# Altium schematic sheet плп-u_2с.SchDoc
size 594 x 420 mm; PageSetup: Record=PageOptions|CenterHorizontal=False|CenterVertical=False|PrintScale=0.68|XCorrection=0.00|YCorrection=0.00|PrintKind=2|BorderSize=5000000|LeftOffset=0|BottomOffset=0|Orientation=2|PaperLength=4200|PaperWidth=2970|Scale=100|PaperSource=7|PrintQuality=600|MediaType=1|DitherType=10|PaperKind=A3|PrintScaleMode=1; Rule: PcbType=ProtelPcb; Rule: PcbType=ProtelPcb; Rule: PcbType=ProtelPcb; Rule: PcbType=ProtelPcb; Rule: PcbType=ProtelPcb; Rule: PcbType=ProtelPcb; Rule: PcbType=ProtelPcb; Rule: PcbType=ProtelPcb; Rule: PcbType=ProtelPcb; Rule: PcbType=ProtelPcb; Rule: PcbType=ProtelPcb; Rule: PcbType=ProtelPcb
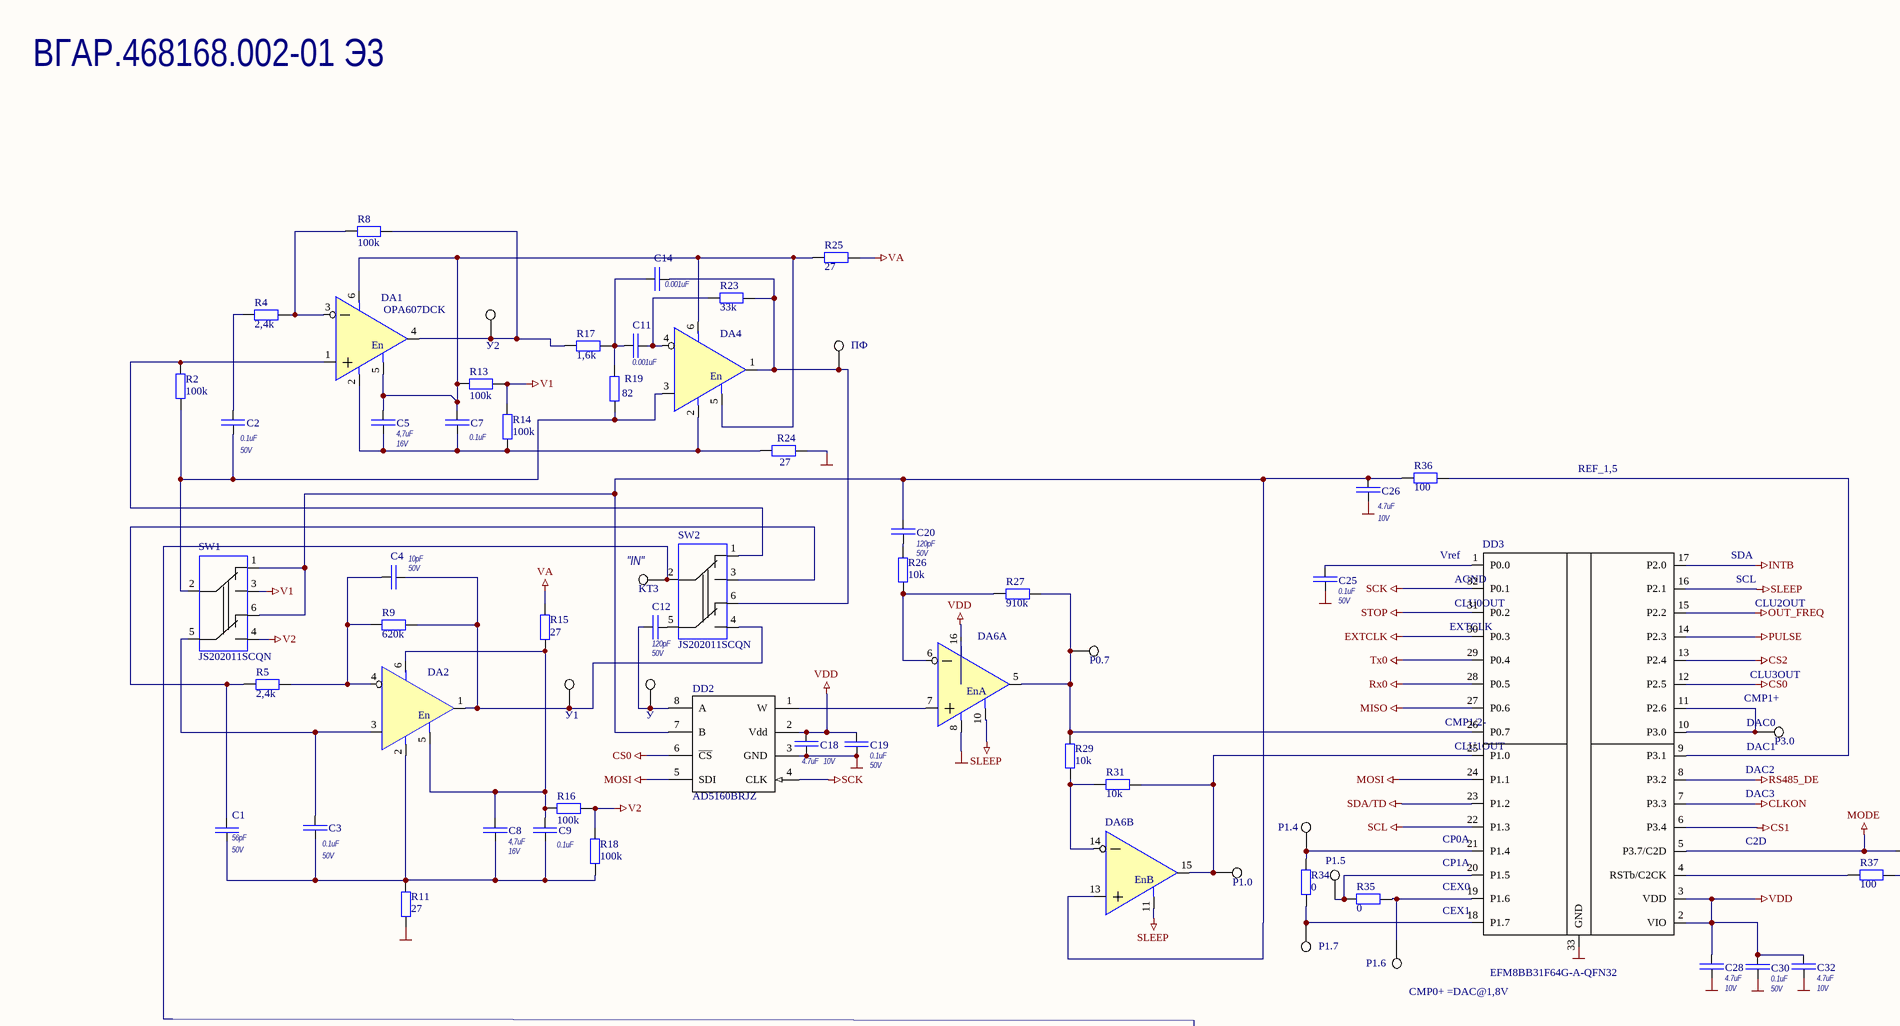
[diagram p0: плп-u_2с.SchDoc, top left]
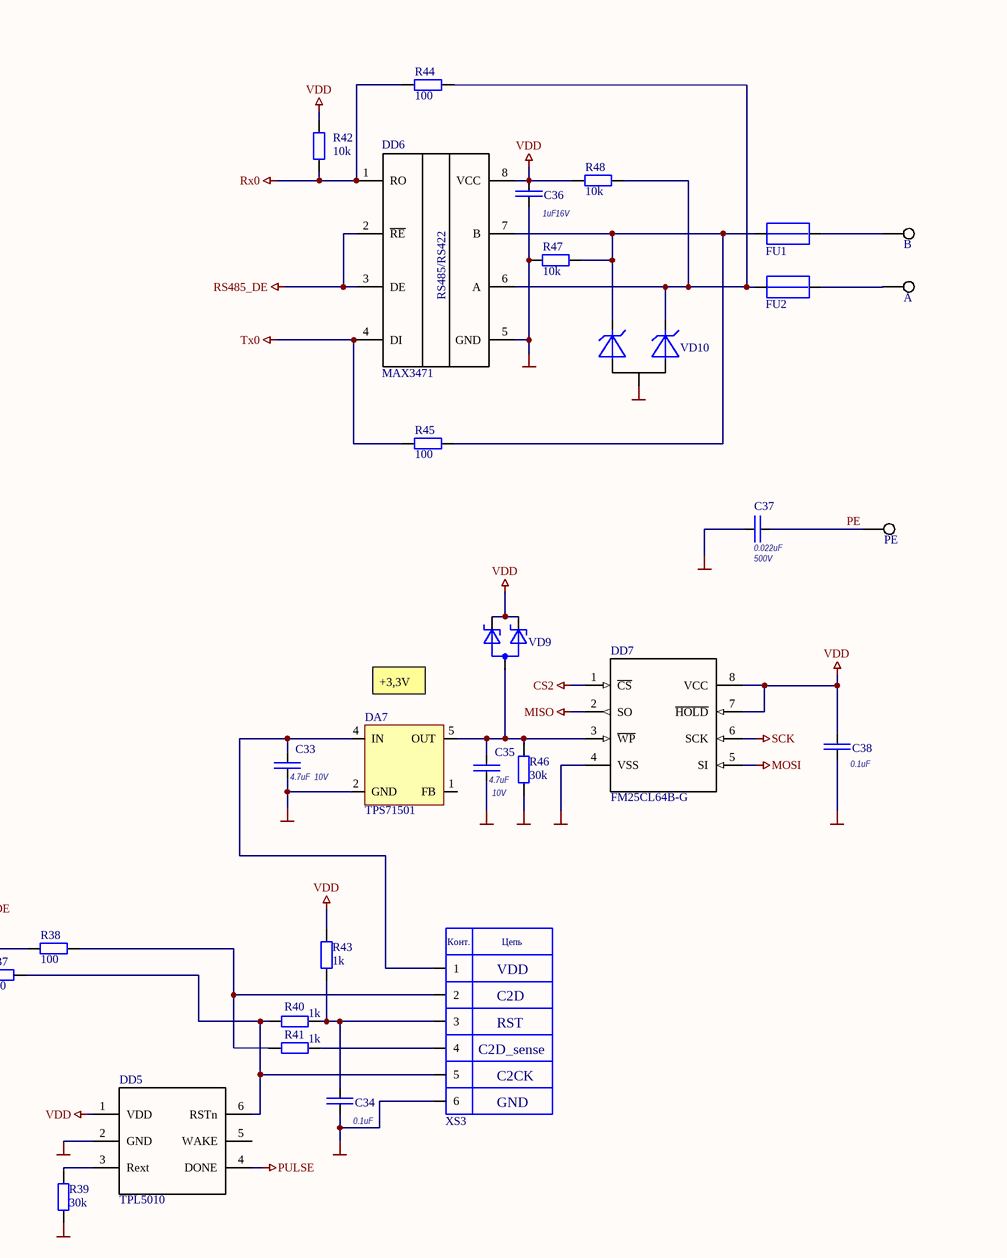
[diagram p1: плп-u_2с.SchDoc, top right]
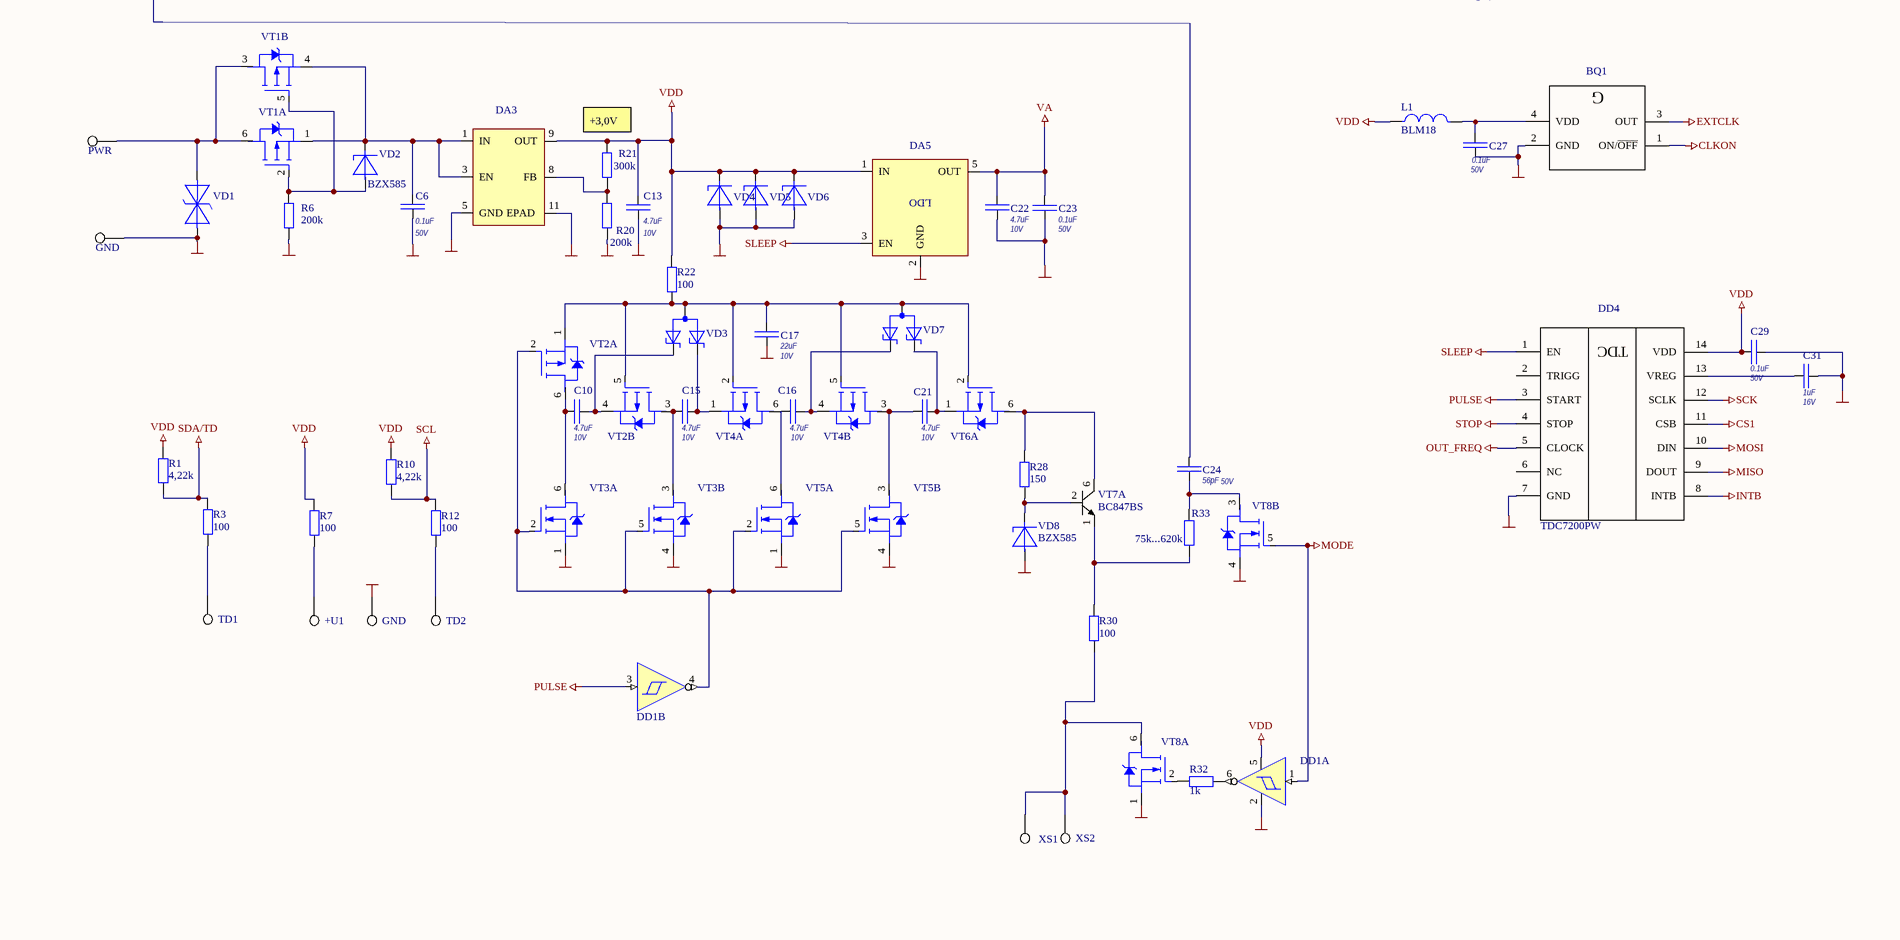
[diagram p2: плп-u_2с.SchDoc, bottom left]
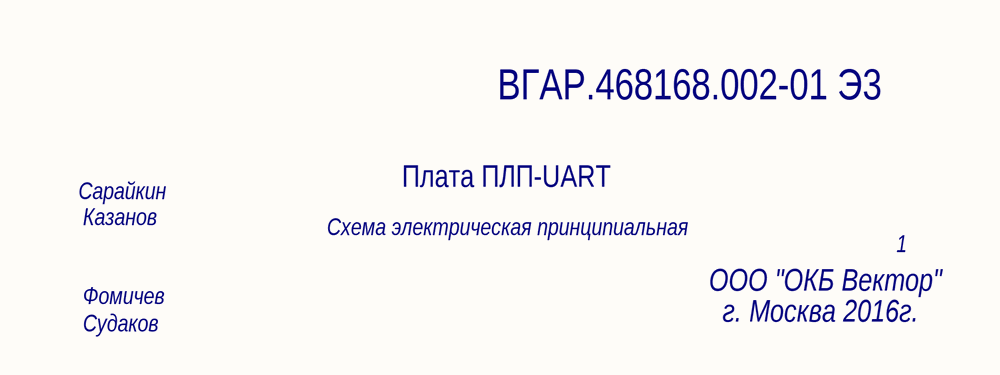
[diagram p3: плп-u_2с.SchDoc, bottom right]

## Parts
(Parts that share a designator on the sheet are numbered #1, #2 ... from top to bottom, then left to right.)
+U1  Testpoint-TH-1mm  [1mm PAD]  (value not drawn)  (net tie, no BOM)
A  Testpoint-TH-1mm  [1mm PAD]  (value not drawn)  (net tie, no BOM)
B  Testpoint-TH-1mm  [1mm PAD]  (value not drawn)  (net tie, no BOM)
BQ1  AMPMG  [AMPMG]  (value not drawn)
C1  value 56pF  Rated DC Voltage: 50V  [CAPC_0603(1608)X080L]  (hidden comment: Capacitor Ceramic)
C2  value 0.1uF  Rated DC Voltage: 50V  [CAPC_0603(1608)X080L]  (hidden comment: Capacitor Ceramic)
C3  value 0.1uF  Rated DC Voltage: 50V  [CAPC_0603(1608)X080L]  (hidden comment: Capacitor Ceramic)
C4  value 10pF  Rated DC Voltage: 50V  [CAPC_0603(1608)X080L]  (hidden comment: Capacitor Ceramic)
C5  value 4,7uF  Rated DC Voltage: 16V  [CAPC_0603(1608)X080L]  (hidden comment: Capacitor Ceramic)
C6  value 0.1uF  Rated DC Voltage: 50V  [CAPC_0603(1608)X080L]  (hidden comment: Capacitor Ceramic)
C7  value 0.1uF  [CAPC_0603(1608)X080L]  (hidden comment: Capacitor Ceramic)
C8  value 4,7uF  Rated DC Voltage: 16V  [CAPC_0603(1608)X080L]  (hidden comment: Capacitor Ceramic)
C9  value 0.1uF  [CAPC_0603(1608)X080L]  (hidden comment: Capacitor Ceramic)
C10  value 4.7uF  Rated DC Voltage: 10V  [CAPC_0603(1608)X080L]  (hidden comment: Capacitor Ceramic)
C11  value 0.001uF  [CAPC_0603(1608)X080L]  (hidden comment: Capacitor Ceramic)
C12  value 120pF  Rated DC Voltage: 50V  [CAPC_0603(1608)X080L]  (hidden comment: Capacitor Ceramic)
C13  value 4.7uF  Rated DC Voltage: 10V  [CAPC_0603(1608)X080L]  (hidden comment: Capacitor Ceramic)
C14  value 0.001uF  [CAPC_0603(1608)X080L]  (hidden comment: Capacitor Ceramic)
C15  value 4.7uF  Rated DC Voltage: 10V  [CAPC_0603(1608)X080L]  (hidden comment: Capacitor Ceramic)
C16  value 4.7uF  Rated DC Voltage: 10V  [CAPC_0603(1608)X080L]  (hidden comment: Capacitor Ceramic)
C17  value 22uF  Rated DC Voltage: 10V  [CAPC_0603(1608)X080L]  (hidden comment: Capacitor Ceramic)
C18  value 4.7uF  Rated DC Voltage: 10V  [CAPC_0603(1608)X080L]  (hidden comment: Capacitor Ceramic)
C19  value 0.1uF  Rated DC Voltage: 50V  [CAPC_0603(1608)X080L]  (hidden comment: Capacitor Ceramic)
C20  value 120pF  Rated DC Voltage: 50V  [CAPC_0603(1608)X080L]  (hidden comment: Capacitor Ceramic)
C21  value 4.7uF  Rated DC Voltage: 10V  [CAPC_0603(1608)X080L]  (hidden comment: Capacitor Ceramic)
C22  value 4.7uF  Rated DC Voltage: 10V  [CAPC_0603(1608)X080L]  (hidden comment: Capacitor Ceramic)
C23  value 0.1uF  Rated DC Voltage: 50V  [CAPC_0603(1608)X080L]  (hidden comment: Capacitor Ceramic)
C24  value 56pF  Rated DC Voltage: 50V  [CAPC_0603(1608)X080L]  (hidden comment: Capacitor Ceramic)
C25  Rated DC Voltage: 50V  [CAPC_0603(1608)X080L]  (hidden comment: 0.1uF)
C26  value 4.7uF  Rated DC Voltage: 10V  [CAPC_0603(1608)X080L]  (hidden comment: Capacitor Ceramic)
C27  Rated DC Voltage: 50V  [CAPC_0603(1608)X080L]  (hidden comment: 0.1uF)
C28  value 4.7uF  Rated DC Voltage: 10V  [CAPC_0603(1608)X080L]  (hidden comment: Capacitor Ceramic)
C29  Rated DC Voltage: 50V  [CAPC_0603(1608)X080L]  (hidden comment: 0.1uF)
C30  Rated DC Voltage: 50V  [CAPC_0603(1608)X080L]  (hidden comment: 0.1uF)
C31  Rated DC Voltage: 16V  [CAPC_0603(1608)X080L]  (hidden comment: 1uF)
C32  value 4.7uF  Rated DC Voltage: 10V  [CAPC_0603(1608)X080L]  (hidden comment: Capacitor Ceramic)
C33  value 4.7uF  Rated DC Voltage: 10V  [CAPC_0603(1608)X080L]  (hidden comment: Capacitor Ceramic)
C34  value 0.1uF  [CAPC_0603(1608)X080L]  (hidden comment: Capacitor Ceramic)
C35  value 4.7uF  Rated DC Voltage: 10V  [CAPC_0603(1608)X080L]  (hidden comment: Capacitor Ceramic)
C36  Rated DC Voltage: 16V  [CAPC_0603(1608)X080L]  (hidden comment: 1uF)
C37  Rated DC Voltage: 500V  [CAPC_1206(3216)X10L]  (hidden comment: 0.022uF)
C38  value 0.1uF  [CAPC_0603(1608)X080L]  (hidden comment: Capacitor Ceramic)
DA1  OPA607DCK  [SC-70-6]
DA2  OPA363AIDBV  [SOT23-6]  (value not drawn)
DA3  IFX30081LDV  [PG-TSON-10]  (value not drawn)
DA4  OPA363AIDBV  [SOT23-6]  (value not drawn)
DA5  lp5907MFX  [SOT23-5]  (value not drawn)
DA6  OPA2363RSV  [UQFN-16]  (value not drawn)  (parts A,B of 2)
DA7  TPS71501  [SC-70-5]
DD1  NC7WZ14P6X  [SC-70-6]  (value not drawn)  (parts A,B of 2)
DD2  AD5160BRJZ  [SOT23-8]
DD3  EFM8BB31F64G-A-QFN32  [QFN-32 - efm8 - SiLabs]
DD4  TDC7200PW  [TSSOP-14]
DD5  TPL5010  [SOT23-6]
DD6  MAX3471  [MSOP-8]
DD7  FM25CL64B-G  [TDFN-8_4х4,5mm]
FU1  0ZCM00xxFF2G  [0ZCM00xxFF2G]  (value not drawn)
FU2  0ZCM00xxFF2G  [0ZCM00xxFF2G]  (value not drawn)
GND#1  Testpoint-TH-1mm  [1mm PAD]  (value not drawn)  (net tie, no BOM)
GND#2  Testpoint-TH-1mm  [1mm PAD]  (value not drawn)  (net tie, no BOM)
KT3  Testpoint-TH-1mm  [1mm PAD]  (value not drawn)  (net tie, no BOM)
L1  BLM18  [INDC_0603(1608)X045]
P0.7  Testpoint-TH-1mm  [1mm PAD]  (value not drawn)  (net tie, no BOM)
P1.0  Testpoint-TH-1mm  [1mm PAD]  (value not drawn)  (net tie, no BOM)
P1.4  Testpoint-TH-1mm  [1mm PAD]  (value not drawn)  (net tie, no BOM)
P1.5  Testpoint-TH-1mm  [1mm PAD]  (value not drawn)  (net tie, no BOM)
P1.6  Testpoint-TH-1mm  [1mm PAD]  (value not drawn)  (net tie, no BOM)
P1.7  Testpoint-TH-1mm  [1mm PAD]  (value not drawn)  (net tie, no BOM)
P3.0  Testpoint-TH-1mm  [1mm PAD]  (value not drawn)  (net tie, no BOM)
PE  Testpoint-TH-1mm  [1mm PAD]  (value not drawn)  (net tie, no BOM)
PWR  Testpoint-TH-1mm  [1mm PAD]  (value not drawn)  (net tie, no BOM)
R1  value 4,22k  [RESC1608(0603)X04L]  (hidden comment: R0603L)
R2  value 100k  [RESC1608(0603)X04L]  (hidden comment: R0603L)
R3  value 100  [RESC1608(0603)X04L]  (hidden comment: R0603L)
R4  value 2,4k  [RESC1608(0603)X04L]  (hidden comment: R0603L)
R5  value 2,4k  [RESC1608(0603)X04L]  (hidden comment: R0603L)
R6  value 200k  [RESC1608(0603)X04L]  (hidden comment: R0603L)
R7  value 100  [RESC1608(0603)X04L]  (hidden comment: R0603L)
R8  value 100k  [RESC1608(0603)X04L]  (hidden comment: R0603L)
R9  value 620k  [RESC1608(0603)X04L]  (hidden comment: R0603L)
R10  value 4,22k  [RESC1608(0603)X04L]  (hidden comment: R0603L)
R11  value 27  [RESC1608(0603)X04L]  (hidden comment: R0603L)
R12  value 100  [RESC1608(0603)X04L]  (hidden comment: R0603L)
R13  value 100k  [RESC1608(0603)X04L]  (hidden comment: R0603L)
R14  value 100k  [RESC1608(0603)X04L]  (hidden comment: R0603L)
R15  value 27  [RESC1608(0603)X04L]  (hidden comment: R0603L)
R16  value 100k  [RESC1608(0603)X04L]  (hidden comment: R0603L)
R17  value 1,6k  [RESC1608(0603)X04L]  (hidden comment: R0603L)
R18  value 100k  [RESC1608(0603)X04L]  (hidden comment: R0603L)
R19  value 82  [RESC1608(0603)X04L]  (hidden comment: R0603L)
R20  value 200k  [RESC1608(0603)X04L]  (hidden comment: R0603L)
R21  value 300k  [RESC1608(0603)X04L]  (hidden comment: R0603L)
R22  value 100  [RESC1608(0603)X04L]  (hidden comment: R0603L)
R23  value 33k  [RESC1608(0603)X04L]  (hidden comment: R0603L)
R24  value 27  [RESC1608(0603)X04L]  (hidden comment: R0603L)
R25  value 27  [RESC1608(0603)X04L]  (hidden comment: R0603L)
R26  value 10k  [RESC1608(0603)X04L]  (hidden comment: R0603L)
R27  value 910k  [RESC1608(0603)X04L]  (hidden comment: R0603L)
R28  value 150  [RESC1608(0603)X04L]  (hidden comment: R0603L)
R29  value 10k  [RESC1608(0603)X04L]  (hidden comment: R0603L)
R30  value 100  [RESC1608(0603)X04L]  (hidden comment: R0603L)
R31  value 10k  [RESC1608(0603)X04L]  (hidden comment: R0603L)
R32  value 1k  [RESC1608(0603)X04L]  (hidden comment: R0603L)
R33  value 75k...620k  [RESC1608(0603)X04L]  (hidden comment: R0603L)
R34  value 0  [RESC1608(0603)X04L]  (hidden comment: R0603L)
R35  value 0  [RESC1608(0603)X04L]  (hidden comment: R0603L)
R36  value 100  [RESC1608(0603)X04L]  (hidden comment: R0603L)
R37  value 100  [RESC1608(0603)X04L]  (hidden comment: R0603L)
R38  value 100  [RESC1608(0603)X04L]  (hidden comment: R0603L)
R39  value 30k  [RESC1608(0603)X04L]  (hidden comment: R0603L)
R40  value 1k  [RESC1608(0603)X04L]  (hidden comment: R0603L)
R41  value 1k  [RESC1608(0603)X04L]  (hidden comment: R0603L)
R42  value 10k  [RESC1608(0603)X04L]  (hidden comment: R0603L)
R43  value 1k  [RESC1608(0603)X04L]  (hidden comment: R0603L)
R44  value 100  [RESC1608(0603)X04L]  (hidden comment: R0603L)
R45  value 100  [RESC1608(0603)X04L]  (hidden comment: R0603L)
R46  value 30k  [RESC1608(0603)X04L]  (hidden comment: R0603L)
R47  value 10k  [RESC1608(0603)X04L]  (hidden comment: 0)
R48  value 10k  [RESC1608(0603)X04L]  (hidden comment: 0)
SW1  JS202011SCQN  [JS202011SCQN]
SW2  JS202011SCQN  [JS202011SCQN]
TD1  Testpoint-TH-1mm  [1mm PAD]  (value not drawn)  (net tie, no BOM)
TD2  Testpoint-TH-1mm  [1mm PAD]  (value not drawn)  (net tie, no BOM)
VD1  Transil Bi  [SMB - UNI]  (value not drawn)
VD2  BZX585  [SOD523]
VD3  BAT54AW  [SC-70]  (value not drawn)
VD4  PTVSxP1UTP  [SOD128]  (value not drawn)
VD5  PTVSxP1UTP  [SOD128]  (value not drawn)
VD6  PTVSxP1UTP  [SOD128]  (value not drawn)
VD7  BAT54AW  [SC-70]  (value not drawn)
VD8  BZX585  [SOD523]
VD9  BAT54AW  [SC-70]  (value not drawn)
VD10  SM712  [SOT23]  (value not drawn)
VT1  BSS84AKS  [SC-70-6]  (value not drawn)  (parts A,B of 2)
VT2  BSS84AKS  [SC-70-6]  (value not drawn)  (parts A,B of 2)
VT3  BSS138PS  [SC-70-6]  (value not drawn)  (parts A,B of 2)
VT4  BSS84AKS  [SC-70-6]  (value not drawn)  (parts A,B of 2)
VT5  BSS138PS  [SC-70-6]  (value not drawn)  (parts A,B of 2)
VT6  BSS84AKS  [SC-70-6]  (value not drawn)  (part A of 2)
VT7  BC847BS  [SC-70-6]  (part A of 2)
VT8  BSS138PS  [SC-70-6]  (value not drawn)  (parts A,B of 2)
XS1  Testpoint-TH-1mm  [1mm PAD]  (value not drawn)  (net tie, no BOM)
XS2  Testpoint-TH-1mm  [1mm PAD]  (value not drawn)  (net tie, no BOM)
XS3  PBD1.27-06S  [PBD1.27-06S]  (value not drawn)
ПФ  Testpoint-TH-1mm  [1mm PAD]  (value not drawn)  (net tie, no BOM)
У  Testpoint-TH-1mm  [1mm PAD]  (value not drawn)  (net tie, no BOM)
У1  Testpoint-TH-1mm  [1mm PAD]  (value not drawn)  (net tie, no BOM)
У2  Testpoint-TH-1mm  [1mm PAD]  (value not drawn)  (net tie, no BOM)

## Nets
CLKON: BQ1.1(ON/~{OFF}) DD3.7(P3.3)
CS0: DD2.6(~{CS}) DD3.12(P2.5)
CS1: DD3.6(P3.4) DD4.11(CSB)
CS2: DD3.13(P2.4) DD7.1(~{CS})
EXTCLK: BQ1.3(OUT) DD3.30(P0.3)
GND: BQ1.2(GND) C6.2 C13.1 C17.1 C18.1 C19.2 C22.1 C23.2 C25.1 C26.1 C27.2 C28.1 C29.1 C30.1 C31.1 C32.1 C33.1 C34.2 C35.1 C36.1 C37.1 C38.2 DA3.5(GND) DA3.11(EPAD) DA5.2(GND) DA6.8(-V) DA7.2(GND) DD1.2(GND) DD2.3(GND) DD3.33(GND) DD4.7(GND) DD5.2(GND) DD6.5(GND) DD7.4(VSS) GND#1.0 GND#2.0 R6.1 R11.2 R20.1 R24.2 R39.1 R46.2 R47.1 VD1.1(C) VD4.2(A) VD5.2(A) VD6.2(A) VD8.2(A) VD10.3(A) VT3.1(S1) VT3.4(S2) VT5.1(S1) VT5.4(S2) VT8.1(S1) VT8.4(S2) XS3.6
INTB: DD3.17(P2.0) DD4.8(INTB)
MISO: DD3.27(P0.6) DD4.9(DOUT) DD7.2(SO)
MODE: DD1.1(A1) DD3.5(P3.7/C2D) R38.2 VT8.5(G2)
MOSI: DD2.5(SDI) DD3.24(P1.1) DD4.10(DIN) DD7.5(SI)
OUT_FREQ: DD3.15(P2.2) DD4.5(CLOCK)
PULSE: DD1.3(A2) DD3.14(P2.3) DD4.3(START) DD5.4(DONE)
RS485_DE: DD3.8(P3.2) DD6.2(~{RE}) DD6.3(DE)
Rx0: DD3.28(P0.5) DD6.1(RO) R42.1 R44.1
SCK: DD2.4(CLK) DD3.32(P0.1) DD4.12(SCLK) DD7.6(SCK)
SCL: DD3.22(P1.3) R10.2 R12.2
SDA/TD: DD3.23(P1.2) R1.2 R3.2
SLEEP: DA5.3(EN) DA6.10(ENA) DA6.11(EN) DD3.16(P2.1) DD4.1(EN)
STOP: DD3.31(P0.2) DD4.4(STOP)
Tx0: DD3.29(P0.4) DD6.4(DI) R45.1
V1: R13.1 R14.1 SW1.3
V2: R16.1 R18.1 SW1.4
VA: C22.2 C23.1 DA5.5(OUT) R15.1 R25.2
VDD: C13.2 C18.2 C19.1 C28.2 C29.2 C30.2 C32.2 C36.2 C38.1 DA3.9(OUT) DA5.1(IN) DA6.16(+V) DD1.5(Vdd) DD2.2(Vdd) DD3.2(VIO) DD3.3(VDD) DD4.14(VDD) DD5.1(VDD) DD6.8(VCC) DD7.7(~{HOLD}) DD7.8(VCC) L1.1 R1.1 R7.2 R10.1 R21.2 R22.2 R42.2 R43.2 R48.1 VD4.1(C) VD5.1(C) VD6.1(C) VD9.1(C) VD9.2(C)
PE: C37.2 PE.0
Net+U1_0: +U1.0 R7.1
NetA_0: A.0 FU2.2
NetB_0: B.0 FU1.2
NetBQ1_4: BQ1.4(VDD) C27.1 L1.2
NetC1_1: C1.1 R5.2 SW2.3
NetC1_2: C1.2 C3.2 C8.2 C9.2 DA2.2(-V) R11.1 R18.2
NetC2_1: C2.1 R4.2
NetC2_2: C2.2 DA4.3(+In) R2.1 R19.2 SW1.2
NetC3_1: C3.1 DA2.3(+In) SW1.5
NetC4_1: C4.1 DA2.4(-In) R5.1 R9.1
NetC4_2: C4.2 DA2.1(Vout) R9.2 SW2.4 У1.0
NetC5_1: C5.1 C7.1 DA1.5(EN) DA1.6(+V) DA4.5(EN) DA4.6(+V) R13.2 R25.1
NetC5_2: C5.2 C7.2 DA1.2(-V) DA4.2(-V) R14.2 R24.1
NetC6_1: C6.1 DA3.1(IN) DA3.3(EN) VD2.1(C) VT1.1(S1) VT1.4(S2)
NetC8_1: C8.1 C9.1 DA2.5(EN) DA2.6(+V) R15.2 R16.2
NetC10_1: C10.1 VT2.6(D1) VT3.6(D1)
NetC10_2: C10.2 VD3.1(C) VT2.4(S2)
NetC11_1: C11.1 C14.1 R17.1 R19.1
NetC11_2: C11.2 DA4.4(-In) R23.2
NetC12_1: C12.1 SW2.5
NetC12_2: C12.2 DD2.8(A) У.0
NetC14_2: C14.2 DA4.1(Vout) R23.1 SW2.6 ПФ.0
NetC15_1: C15.1 VT2.3(D2) VT3.3(D2)
NetC15_2: C15.2 VD3.2(C) VT4.1(S1)
NetC16_1: C16.1 VT4.6(D1) VT5.6(D1)
NetC16_2: C16.2 VD7.1(C) VT4.4(S2)
NetC17_2: C17.2 R22.1 VD3.3(OA) VD7.3(OA) VT2.1(S1) VT2.5(G2) VT4.2(G1) VT4.5(G2) VT6.2(G1)
NetC20_1: C20.1 R26.1
NetC20_2: C20.2 C26.2 DA6.13(+InB) DD2.7(B) R36.1 SW1.1 SW1.6
NetC21_1: C21.1 VT4.3(D2) VT5.3(D2)
NetC21_2: C21.2 VD7.2(C) VT6.1(S1)
NetC24_1: C24.1 KT3.0 SW2.2
NetC24_2: C24.2 R33.1 VT8.3(D2)
NetC25_2: C25.2 DD3.1(P0.0)
NetC31_2: C31.2 DD4.13(VREG)
NetC33_2: C33.2 DA7.4(IN) XS3.1
NetC34_1: C34.1 R40.2 R43.1 XS3.3
NetC35_2: C35.2 DA7.5(OUT) DD7.3(~{WP}) R46.1 VD9.3(OA)
NetDA1_1: DA1.1(+In) R2.2 SW2.1
NetDA1_3: DA1.3(-In) R4.1 R8.2
NetDA1_4: DA1.4(Vout) R8.1 R17.2 У2.0
NetDA3_8: DA3.8(FB) R20.2 R21.1
NetDA6_5: DA6.5(VoutA) DD3.26(P0.7) P0.7.0 R27.2 R29.2
NetDA6_6: DA6.6(-InA) R26.2 R27.1
NetDA6_7: DA6.7(+InA) DD2.1(W)
NetDA6_14: DA6.14(-InB) R29.1 R31.1
NetDA6_15: DA6.15(Vout) DD3.25(P1.0) P1.0.0 R31.2
NetDD1_4: DD1.4(Y2) VT2.2(G1) VT3.2(G1) VT3.5(G2) VT5.2(G1) VT5.5(G2)
NetDD1_6: DD1.6(Y1) R32.2
NetDD3_4: DD3.4(RSTb/C2CK) R37.2
NetDD3_9: DD3.9(P3.1) R36.2
NetDD3_10: DD3.10(P3.0) DD3.11(P2.6) P3.0.0
NetDD3_18: DD3.18(P1.7) P1.7.0 R34.1
NetDD3_19: DD3.19(P1.6) P1.6.0 R35.1
NetDD3_20: DD3.20(P1.5) P1.5.0 R35.2
NetDD3_21: DD3.21(P1.4) P1.4.0 R34.2
NetDD5_3: DD5.3(Rext) R39.2
NetDD5_6: DD5.6(RSTn) R37.1 R40.1 XS3.5
NetDD6_6: DD6.6(A) FU2.1 R44.2 R48.2 VD10.1(C)
NetDD6_7: DD6.7(B) FU1.1 R45.2 R47.2 VD10.2(C)
NetPWR_0: PWR.0 VD1.2(A) VT1.3(D2) VT1.6(D1)
NetR3_1: R3.1 TD1.0
NetR6_2: R6.2 VD2.2(A) VT1.2(G1) VT1.5(G2)
NetR12_1: R12.1 TD2.0
NetR28_1: R28.1 VD8.1(C) VT7.2(B1)
NetR28_2: R28.2 VT6.6(D1) VT7.6(C1)
NetR30_1: R30.1 VT8.6(D1) XS1.0 XS2.0
NetR30_2: R30.2 R33.2 VT7.1(E1)
NetR32_1: R32.1 VT8.2(G1)
NetR38_1: R38.1 R41.1 XS3.2
NetR41_2: R41.2 XS3.4

Not connected (* = marked no-connect by the designer): DA7 1(FB); DD4 2(TRIGG) 6(NC); DD5 5(WAKE)

## Notes on the sheet
- ВГАР.468168.002-01 Э3
- REF_1,5
- (near KT3) "IN"
- (near DD3) Vref
- (near DD3) SDA
- (near DD3) EXTCLK
- (near DD3) AGND
- (near DD3) CLU0OUT
- (near DD3) SCL
- (near DD3) CLU2OUT
- +3,3V
- CLU3OUT
- (near DD3) CMP1/2-
- (near DD3) CLU1OUT
- CMP1+
- DAC0
- DAC1
- DAC2
- DAC3
- (near DD3) CP0A
- CP1A
- C2D
- CEX1
- CEX0
- (near XS3) VDD
- (near XS3) C2D
- (near XS3) RST
- (near XS3) C2D_sense
- (near XS3) GND
- (near XS3) C2CK
- (near P1.6) CMP0+ =DAC@1,8V
- (near R21) +3,0V
- Плата ПЛП-UART
- Сарайкин
- Казанов
- Схема электрическая принципиальная
- 1
- Фомичев
- ООО "ОКБ Вектор"
- г. Москва 2016г.
- Судаков
- Перв. примен.
- Справ. №
- Подп. и дата
- Инв. № дубл.
- Взам. инв. №
- Изм.
- Лист
- № докум.
- Подп.
- Дата
- Лит.
- Масса
- Масштаб
- Т.контр.
- Пров.
- Разраб.
- Листов
- Инв. № подл.
- Н.контр.
- Утв.
- Копировал
- Формат А2
- (in symbol AMPMG) G
- (in symbol lp5907MFX) LDO
- (in symbol MAX3471) RS485/RS422
- (in symbol OPA363AIDBV) En
- (in symbol OPA607DCK) En
- (in symbol OPA2363RSV, part A) EnA
- (in symbol OPA2363RSV, part B) EnB
- (in symbol PBD1.27-06S) Конт.; Цепь
- (in symbol TDC7200) TDC

## Library data of the parts
+U1 A B GND#1 GND#2 KT3 P0.7 P1.0 P1.4-P1.7 P3.0 PE PWR TD1 TD2 XS1 XS2 ПФ У У1 У2 = Testpoint-TH-1mm: Dummy Pad
C1 C24 = Capacitor Ceramic: Конденсатор; Manufacturer: Murata; ReplacementPart1Manufacturer: TDK; ReplacementPart2Manufacturer: Taiyo Yuden; ESR: * mOhm; OrderCode: 0603 - 56пФ ±10% - 50В - NPO; TC Code: NPO; Tolerance: ±5%; Case: 0603; ComponentLink1Description: Global Data; ComponentLink1URL: http://www.murata.com/products/capacitor/tech_data/index.html; ComponentLink2Description: Part Data Sheet; ComponentLink2URL: *; ComponentLink3Description: Replacement Data Sheet; ComponentLink3URL: *; ComponentLink4Description: Replacement 2 Data Sheet; ComponentLink4URL: *; PartNumber: *; ReplacementPart1PartNumber: *; ReplacementPart2PartNumber: *; Ripple Current Rating: *; Temperature Range: -55 to +125°C
C2 C3 C6 C19 C23 = Capacitor Ceramic: Конденсатор; Manufacturer: Murata; ReplacementPart1Manufacturer: TDK; ReplacementPart2Manufacturer: Taiyo Yuden; ESR: * mOhm; OrderCode: 0603 - 0,1мкФ ±10% - 50В - X7R; TC Code: X7R; Tolerance: ±10%; Case: 0603; ComponentLink1Description: Global Data; ComponentLink1URL: http://www.murata.com/products/capacitor/tech_data/index.html; ComponentLink2Description: Part Data Sheet; ComponentLink2URL: *; ComponentLink3Description: Replacement Data Sheet; ComponentLink3URL: *; ComponentLink4Description: Replacement 2 Data Sheet; ComponentLink4URL: *; PartNumber: *; ReplacementPart1PartNumber: *; ReplacementPart2PartNumber: *; Ripple Current Rating: *; Temperature Range: -55 to +125°C
C4 = Capacitor Ceramic: Конденсатор; Manufacturer: Murata; ReplacementPart1Manufacturer: TDK; ReplacementPart2Manufacturer: Taiyo Yuden; ESR: * mOhm; OrderCode: 0603 - 10 пФ ±5% 50 В- NPO; TC Code: NPO; Tolerance: ±5%; Case: 0603; ComponentLink1Description: Global Data; ComponentLink1URL: http://www.murata.com/products/capacitor/tech_data/index.html; ComponentLink2Description: Part Data Sheet; ComponentLink2URL: *; ComponentLink3Description: Replacement Data Sheet; ComponentLink3URL: *; ComponentLink4Description: Replacement 2 Data Sheet; ComponentLink4URL: *; PartNumber: *; ReplacementPart1PartNumber: *; ReplacementPart2PartNumber: *; Ripple Current Rating: *; Temperature Range: -55 to +125°C
C5 C8 = Capacitor Ceramic: Конденсатор; Manufacturer: Murata; ReplacementPart1Manufacturer: TDK; ReplacementPart2Manufacturer: Taiyo Yuden; ESR: * mOhm; OrderCode: 0603 - 10мкФ ±10% - 6.3В - X5R; TC Code: X5R; Tolerance: ±10%; Case: 0603; ComponentLink1Description: Global Data; ComponentLink1URL: http://www.murata.com/products/capacitor/tech_data/index.html; ComponentLink2Description: Part Data Sheet; ComponentLink2URL: *; ComponentLink3Description: Replacement Data Sheet; ComponentLink3URL: *; ComponentLink4Description: Replacement 2 Data Sheet; ComponentLink4URL: *; PartNumber: *; ReplacementPart1PartNumber: *; ReplacementPart2PartNumber: *; Ripple Current Rating: *; Temperature Range: -55 to +125°C
C7 C9 C11 C14 C34 C38 = Capacitor Ceramic: Конденсатор; Manufacturer: Murata; ReplacementPart1Manufacturer: TDK; ReplacementPart2Manufacturer: Taiyo Yuden; ESR: * mOhm; OrderCode: 0603 - 0,1мкФ ±10% - 50В - X7R; TC Code: X7R; Tolerance: ±10%; Rated DC Voltage: 50V; Case: 0603; ComponentLink1Description: Global Data; ComponentLink1URL: http://www.murata.com/products/capacitor/tech_data/index.html; ComponentLink2Description: Part Data Sheet; ComponentLink2URL: *; ComponentLink3Description: Replacement Data Sheet; ComponentLink3URL: *; ComponentLink4Description: Replacement 2 Data Sheet; ComponentLink4URL: *; PartNumber: *; ReplacementPart1PartNumber: *; ReplacementPart2PartNumber: *; Ripple Current Rating: *; Temperature Range: -55 to +125°C
C10 C15-C17 C21 = Capacitor Ceramic: Конденсатор; Manufacturer: Murata; ReplacementPart1Manufacturer: TDK; ReplacementPart2Manufacturer: Taiyo Yuden; ESR: * mOhm; OrderCode: 0603 - 2,2мкФ ±10% - 10В - X5R; TC Code: X5R; Tolerance: ±10%; Case: 0603; ComponentLink1Description: Global Data; ComponentLink1URL: http://www.murata.com/products/capacitor/tech_data/index.html; ComponentLink2Description: Part Data Sheet; ComponentLink2URL: *; ComponentLink3Description: Replacement Data Sheet; ComponentLink3URL: *; ComponentLink4Description: Replacement 2 Data Sheet; ComponentLink4URL: *; PartNumber: *; ReplacementPart1PartNumber: *; ReplacementPart2PartNumber: *; Ripple Current Rating: *; Temperature Range: -55 to +125°C
C12 C20 = Capacitor Ceramic: Конденсатор; Manufacturer: Murata; ReplacementPart1Manufacturer: TDK; ReplacementPart2Manufacturer: Taiyo Yuden; ESR: * mOhm; OrderCode: 0603 - 120пФ ±5% 50В - NPO; TC Code: X7R; Tolerance: ±5%; Case: 0603; ComponentLink1Description: Global Data; ComponentLink1URL: http://www.murata.com/products/capacitor/tech_data/index.html; ComponentLink2Description: Part Data Sheet; ComponentLink2URL: *; ComponentLink3Description: Replacement Data Sheet; ComponentLink3URL: *; ComponentLink4Description: Replacement 2 Data Sheet; ComponentLink4URL: *; PartNumber: *; ReplacementPart1PartNumber: *; ReplacementPart2PartNumber: *; Ripple Current Rating: *; Temperature Range: -55 to +125°C
C13 C18 C22 C26 C28 C32 C33 C35 = Capacitor Ceramic: Конденсатор; Manufacturer: Murata; ReplacementPart1Manufacturer: TDK; ReplacementPart2Manufacturer: Taiyo Yuden; ESR: * mOhm; OrderCode: 0603 - 4,7мкФ ±10% - 10В - X5R; TC Code: X5R; Tolerance: ±10%; Case: 0603; ComponentLink1Description: Global Data; ComponentLink1URL: http://www.murata.com/products/capacitor/tech_data/index.html; ComponentLink2Description: Part Data Sheet; ComponentLink2URL: *; ComponentLink3Description: Replacement Data Sheet; ComponentLink3URL: *; ComponentLink4Description: Replacement 2 Data Sheet; ComponentLink4URL: *; PartNumber: *; ReplacementPart1PartNumber: *; ReplacementPart2PartNumber: *; Ripple Current Rating: *; Temperature Range: -55 to +125°C
C25 C27 C29 C30 C37 = Capacitor Ceramic: Конденсатор; Manufacturer: Murata; PartNumber: 0603 - 0,1 мкФ ± 10 % - 50 В - X7R; ReplacementPart1Manufacturer: TDK; ReplacementPart2Manufacturer: Taiyo Yuden; TC Code: X7R; Tolerance: ±10%; Case: 0603; ComponentLink1Description: Global Data; ComponentLink1URL: http://www.murata.com/products/capacitor/tech_data/index.html; ComponentLink2Description: Part Data Sheet; ComponentLink2URL: *; ComponentLink3Description: Replacement Data Sheet; ComponentLink3URL: *; ComponentLink4Description: Replacement 2 Data Sheet; ComponentLink4URL: *; ReplacementPart1PartNumber: *; ReplacementPart2PartNumber: *; Ripple Current Rating: *; Temperature Range: -55 to +125°C
  C25 C27 C29 C30: Value: 0.1uF
  C37: Value: 0.022uF
C31 C36 = Capacitor Ceramic: Конденсатор; Manufacturer: Murata; ReplacementPart1Manufacturer: TDK; ReplacementPart2Manufacturer: Taiyo Yuden; ESR: * mOhm; OrderCode: 0603 - 1мкФ ±10% - 16В - X7R; TC Code: X7R; Tolerance: ±10%; Case: 0603; ComponentLink1Description: Global Data; ComponentLink1URL: http://www.murata.com/products/capacitor/tech_data/index.html; ComponentLink2Description: Part Data Sheet; ComponentLink2URL: *; ComponentLink3Description: Replacement Data Sheet; ComponentLink3URL: *; ComponentLink4Description: Replacement 2 Data Sheet; ComponentLink4URL: *; PartNumber: *; ReplacementPart1PartNumber: *; ReplacementPart2PartNumber: *; Ripple Current Rating: *; Temperature Range: -55 to +125°C; Value: 1uF
DA1 = OPA607DCK: Микросхема; Manufacturer: Texas Instruments; ComponentLink1Description: Data Sheet; ComponentLink2Description: Replacement 1 Data Sheet; ComponentLink2URL: *; ComponentLink3Description: Replacement 2 Data Sheet; ComponentLink3URL: *; ReplacementPart1Manufacturer: *; ReplacementPart1PartNumber: *; ReplacementPart1TopMarking: *; ReplacementPart2Manufacturer: *; ReplacementPart2PartNumber: *; ReplacementPart2TopMarking: *; TopMarking: *
DA2 DA4 = OPA363AIDBV: 1.8V, 7MHz, 90dB CMRR,  Single-Supply, Rail-to-Rail I/O Operational Amplifier
DA5 = lp5907MFX: Микросхема; Manufacturer: Texas Instruments; ComponentLink1Description: Data Sheet; ComponentLink1URL: http://focus.ti.com/lit/ds/symlink/tps7a4901.pdf
DA6 = OPA2363RSV: Микросхема; Manufacturer: Texas Instruments; ComponentLink1Description: Data Sheet; ComponentLink2Description: Replacement 1 Data Sheet; ComponentLink2URL: *; ComponentLink3Description: Replacement 2 Data Sheet; ComponentLink3URL: *; ReplacementPart1Manufacturer: *; ReplacementPart1PartNumber: *; ReplacementPart1TopMarking: *; ReplacementPart2Manufacturer: *; ReplacementPart2PartNumber: *; ReplacementPart2TopMarking: *; TopMarking: *
DA7 = TPS71501: Микросхема; Manufacturer: Texas Instruments; ComponentLink1Description: Data Sheet
DD1 = NC7WZ14P6X: UHS Dual Inverter with Schmitt Trigger Inputs
DD2 = AD5160: Микросхема; Manufacturer: Analog Devices; PartNumber: AD5160BRJZ
DD3 = EFM8BB31F64G-A-QFN32: 48MIPS 64kB Flash 4k RAM 8-Bit Microcontroller; Manufacturer: Silabs; ComponentLink1Description: Data Sheet; ComponentLink2Description: Replacement 1 Data Sheet; ComponentLink3Description: Replacement 2 Data Sheet; PartNumber: EFM8BB31F64G-A-QFN32
DD4 = TDC7200
DD6 = MAX3471: RS-485/RS422Half-Duplex,  Differential Transceiver for Battery-Powered Systems; Manufacturer: MAXIM; ComponentLink1Description: Data Sheet; ComponentLink1URL: \\Mskd20virt\KB\PDF\Интерфейсы\RS232_485\MAX3471.pdf; ComponentLink2Description: Replacement 1 Data Sheet; PartNumber: MAX3471
DD7 = FM25CL64B-G: Микросхема; ReplacementPart1Manufacturer: ISSI; ReplacementPart1PartNumber: IS25C08-2ZLI-TR; ComponentLink1Description: Manufacturer Link; ComponentLink1URL: http://www.microchip.com; ComponentLink2Description: Datasheet; ComponentLink3Description: Packaging Specification; PartNumber: FM25CL64B-G; Manufacturer: FM25CL64B-G
L1 = BLM18: Manufacturer: Murata; ComponentLink1Description: DataSheet; ComponentLink1URL: *; PartNumber: *; Value: *
R1 R3-R8 R10-R48 = R0603L: Резистор; Manufacturer: Bourns; Max Rated DC Voltage: 100 В; Power: 1/10 Вт; Rated DC Voltage: 50 В; Rated T: -55 °C to +125 °C; Resistance Code: 0603 {Value} Ом ±1 %; TKR: ±100 ppm; Tolerance: ±1 %; ComponentLink1Description: Data Sheet; ComponentLink1URL: http://smd.ru/files/upload/1207/ru/chip-resis.pdf; Case: 0603; ComponentLink2Description: Specific Res Only; ComponentLink2URL: *; ComponentLink3Description: Replacement Data Sheet; ComponentLink3URL: *; ComponentLink4Description: Replacement 2 Data Sheet; ComponentLink4URL: *; OrderCode: *; PartNumber: *; ReplacementPart1Manufacturer: *; ReplacementPart1PartNumber: *; ReplacementPart2Manufacturer: *; ReplacementPart2PartNumber: *; Temperature Range: -55 to +125°C
R2 R9 = R0603L: Резистор; Manufacturer: Bourns; Max Rated DC Voltage: 100 В; Power: 1/10 Вт; Rated DC Voltage: 50 В; Rated T: -55 °C to +125 °C; Resistance Code: 0603 240 kОм ±1 %; TKR: ±100 ppm; Tolerance: ±1 %; ComponentLink1Description: Data Sheet; ComponentLink1URL: http://smd.ru/files/upload/1207/ru/chip-resis.pdf; Case: 0603; ComponentLink2Description: Specific Res Only; ComponentLink2URL: *; ComponentLink3Description: Replacement Data Sheet; ComponentLink3URL: *; ComponentLink4Description: Replacement 2 Data Sheet; ComponentLink4URL: *; OrderCode: *; PartNumber: *; ReplacementPart1Manufacturer: *; ReplacementPart1PartNumber: *; ReplacementPart2Manufacturer: *; ReplacementPart2PartNumber: *; Temperature Range: -55 to +125°C
SW1 SW2 = JS202011SCQN: Переключатель; Manufacturer: C&K Component; ReplacementPart1Manufacturer: Китай; ReplacementPart1PartNumber: is-1390; ComponentLink1Description: Data Sheet; ComponentLink1URL: http://www.tycoelectronics.com/catalog/pn/en/1571983-4?RQPN=1571983-4; ComponentLink2Description: Replacement 1 DataSheet
VD1 = Transil Bi: TVS Диод; Manufacturer: ST Microelectronics; ComponentLink1Descriprion: Data Sheet; ComponentLink1URL: *; ComponentLink2Description: Replacement 1 Data Sheet; ComponentLink2URL: *; ComponentLink3Description: Replacement 2 Data Sheet; ComponentLink3URL: *; PartNumber: *; ReplacementPart1Manufacturer: *; ReplacementPart1PartNumber: *; ReplacementPart1TopMarking: *; ReplacementPart2Manufacturer: *; ReplacementPart2TopMarking: *; TopMarking: *; ReplacementPart2PartNumber: *; StandOffVoltage: *
VD2 VD8 = BZX585: Стабилитрон; Manufacturer: NXP; Package: SOD-323F; ComponentLink1Description: DataSheet; ComponentLink1URL: *; Power/Voltage: *; Type: *; ComponentLink2URL: *; ComponentLink3Description: Replacement2DataSheet; ComponentLink3URL: *; ComponentLink2Description: Replacement1DataSheet; ReplacementPart2TopMarking: *; ReplacementPart1Manufacturer: *; ReplacementPart1PartNumber: *; ReplacementPart1TopMarking: *; ReplacementPart2Manufacturer: *
VD3 VD7 VD9 = BAT54AW: Сборка диодная; Manufacturer: NXP; ReplacementPart2TopMarking: TA; ReplacementPart1Manufacturer: ON Semiconductor; ReplacementPart1PartNumber: BAT54AWT1G; ReplacementPart1TopMarking: B7*; ReplacementPart2Manufacturer: Infineon; ReplacementPart2PartNumber: BAT54-06W; TopMarking: 42; Type: *; Power/Voltage: *; PartNumber: BAT54AW; Package: SC-70; ComponentLink1Description: DataSheet; ComponentLink1URL: http://www.nxp.com/documents/data_sheet/BAT54W.pdf; ComponentLink2URL: http://www.onsemi.com/pub_link/Collateral/BAT54AWT1-D.PDF; ComponentLink3Description: Replacement2DataSheet; ComponentLink3URL: http://www.infineon.com/dgdl/bat54series.pdf?folderId=db3a30431400ef68011425f1ca2505e3&fileId=db3a304314dca3890115190b74210ea6; ComponentLink2Description: Replacement1DataSheet
VD4-VD6 = PTVSxP1UTP: TVS-диод; Manufacturer: NXP; Package: SOD-882D; ComponentLink1Description: DataSheet; ComponentLink1URL: *; Power/Voltage: *; Type: *; ComponentLink2URL: *; ComponentLink3Description: Replacement2DataSheet; ComponentLink3URL: *; ComponentLink2Description: Replacement1DataSheet; ReplacementPart2TopMarking: *; ReplacementPart1Manufacturer: *; ReplacementPart1PartNumber: *; ReplacementPart1TopMarking: *; ReplacementPart2Manufacturer: *
VT1 VT2 VT4 VT6 = BSS84AKS: Сборка транзисторная; Manufacturer: Fairchild Semiconductor; ReplacementPart1Manufacturer: ON Semiconductor; ReplacementPart1TopMarking: TK; TopMarking: .16; ComponentLink1Description: Data Sheet; ComponentLink2Description: Replacement 1 Data Sheet; ComponentLink3URL: *; PartNumber: BSS84AKS; ReplacementPart2Manufacturer: *; ReplacementPart2PartNumber: *; ReplacementPart2TopMarking: *; ComponentLink3Description: *
VT3 VT5 VT8 = BSS138PS: Сборка транзисторная; Manufacturer: Fairchild Semiconductor; ReplacementPart1Manufacturer: ON Semiconductor; ReplacementPart1TopMarking: TK; TopMarking: .16; ComponentLink1Description: Data Sheet; ComponentLink2Description: Replacement 1 Data Sheet; ComponentLink3URL: *; PartNumber: BSS138PS; ReplacementPart2Manufacturer: *; ReplacementPart2PartNumber: *; ReplacementPart2TopMarking: *; ComponentLink3Description: *
VT7 = BC847BS: Сборка транзисторная; Manufacturer: Fairchild Semiconductor; ReplacementPart1Manufacturer: ON Semiconductor; ReplacementPart1PartNumber: BC847BDW1T1G; ReplacementPart1TopMarking: 1B; ReplacementPart2Manufacturer: Weitron; ReplacementPart2PartNumber: BC847BDW; ReplacementPart2TopMarking: B1; TopMarking: .1F; ComponentLink1Description: Data Sheet; ComponentLink1URL: http://www.fairchildsemi.com/ds/BC/BC847BS.pdf; ComponentLink2Description: Replacement 1 Data Sheet; ComponentLink2URL: http://www.onsemi.com/pub_link/Collateral/BC846BDW1T1-D.PDF; ComponentLink3Description: Replacement 2 Data Sheet; ComponentLink3URL: http://www.weitron.com.tw/PDF/BC846BDW.pdf; PartNumber: BC847BS
XS3 = PBD1.27-06S: Вилка на плату; Manufacturer: Бурый Медведь; ReplacementPart1Manufacturer: Samtec; ReplacementPart1PartNumber: TMM-102-03-L-D; ComponentLink1Description: Data Sheet; ComponentLink1URL: http://www.brownbear.ru/goods4/1020.html; ComponentLink2Description: Replacement 1Data Sheet; ComponentLink2URL: http://www.samtec.com/documents/webfiles/pdf/TMM_TH.PDF